# Altium schematic sheet MGT_1.8V.SchDoc
size A4
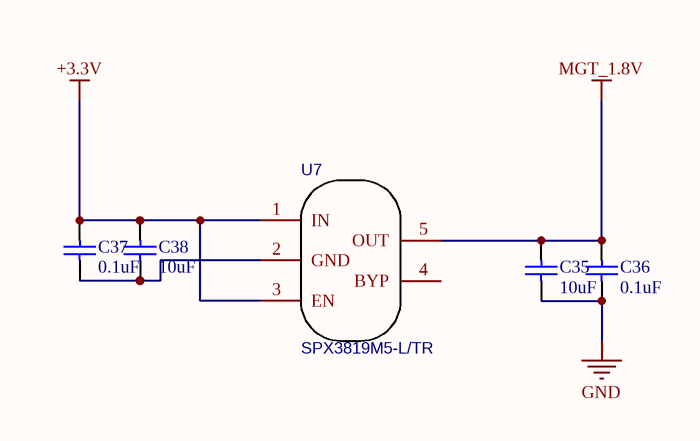
[diagram p0: MGT_1.8V.SchDoc]

## Parts
C35  value 10uF  [C1210]  (hidden comment: Cap Semi)
C36  value 0.1uF  [C1210]  (hidden comment: Cap Semi)
C37  value 0.1uF  [C1210]  (hidden comment: Cap Semi)
C38  value 10uF  [C1210]  (hidden comment: Cap Semi)
U7  SPX3819M5-L/TR  [SOT-23-5_L3.0-W1.7-P0.95-LS2.8-BL]

## Nets
+3.3V: C37.1 C38.1 U7.1(IN) U7.3(EN)
GND: C35.2 C36.2
MGT_1.8V: C35.1 C36.1 U7.5(OUT)
NetC37_2: C37.2 C38.2 U7.2(GND)

Not connected (* = marked no-connect by the designer): U7 4(BYP)

## Library data of the parts
C35-C38 = Cap Semi: Capacitor (Semiconductor SIM Model); Published: 8-Jun-2000; LatestRevisionDate: 29-May-2009; LatestRevisionNote: IPC-7351 Footprint Added.; PackageReference: C1206; Publisher: Altium Limited; PackageDescription: Chip Capacitor
U7 = SPX3819M5-L/TR: BOM_Manufacturer: EXAR; SMT Type: Extend; BOM_Supplier: LCSC; BOM_Manufacturer Part: SPX3819M5-L/TR; image: //image.lceda.cn/szlcsc/C9056.jpg; BOM_Supplier Part: C9056; BOM_LCSC Assembly: Yes; spicePre: U; spiceSymbolName: SPX3819M5-L/TR